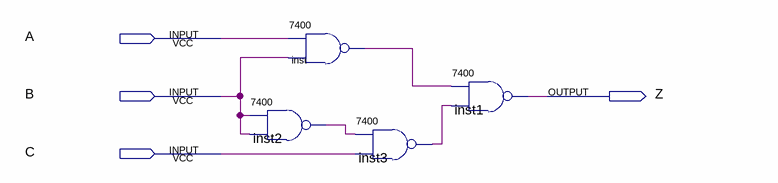
[diagram p0: schematic sheet]
// Quartus schematic lab1.bdf as structural Verilog: 4 symbols, 4 pins
module lab1 (
  input  A,
  input  B,
  input  C,
  output Z
);

  wire inst2_1, inst3_1, inst_1;

  \7400  inst (.\3 (B), .\2 (A), .\1 (inst_1));
  \7400  inst2 (.\3 (B), .\2 (B), .\1 (inst2_1));
  \7400  inst3 (.\3 (C), .\2 (inst2_1), .\1 (inst3_1));
  \7400  inst1 (.\3 (inst3_1), .\2 (inst_1), .\1 (Z));
endmodule
